# EAGLE schematic pure_battery (EAGLE 9.5.2)
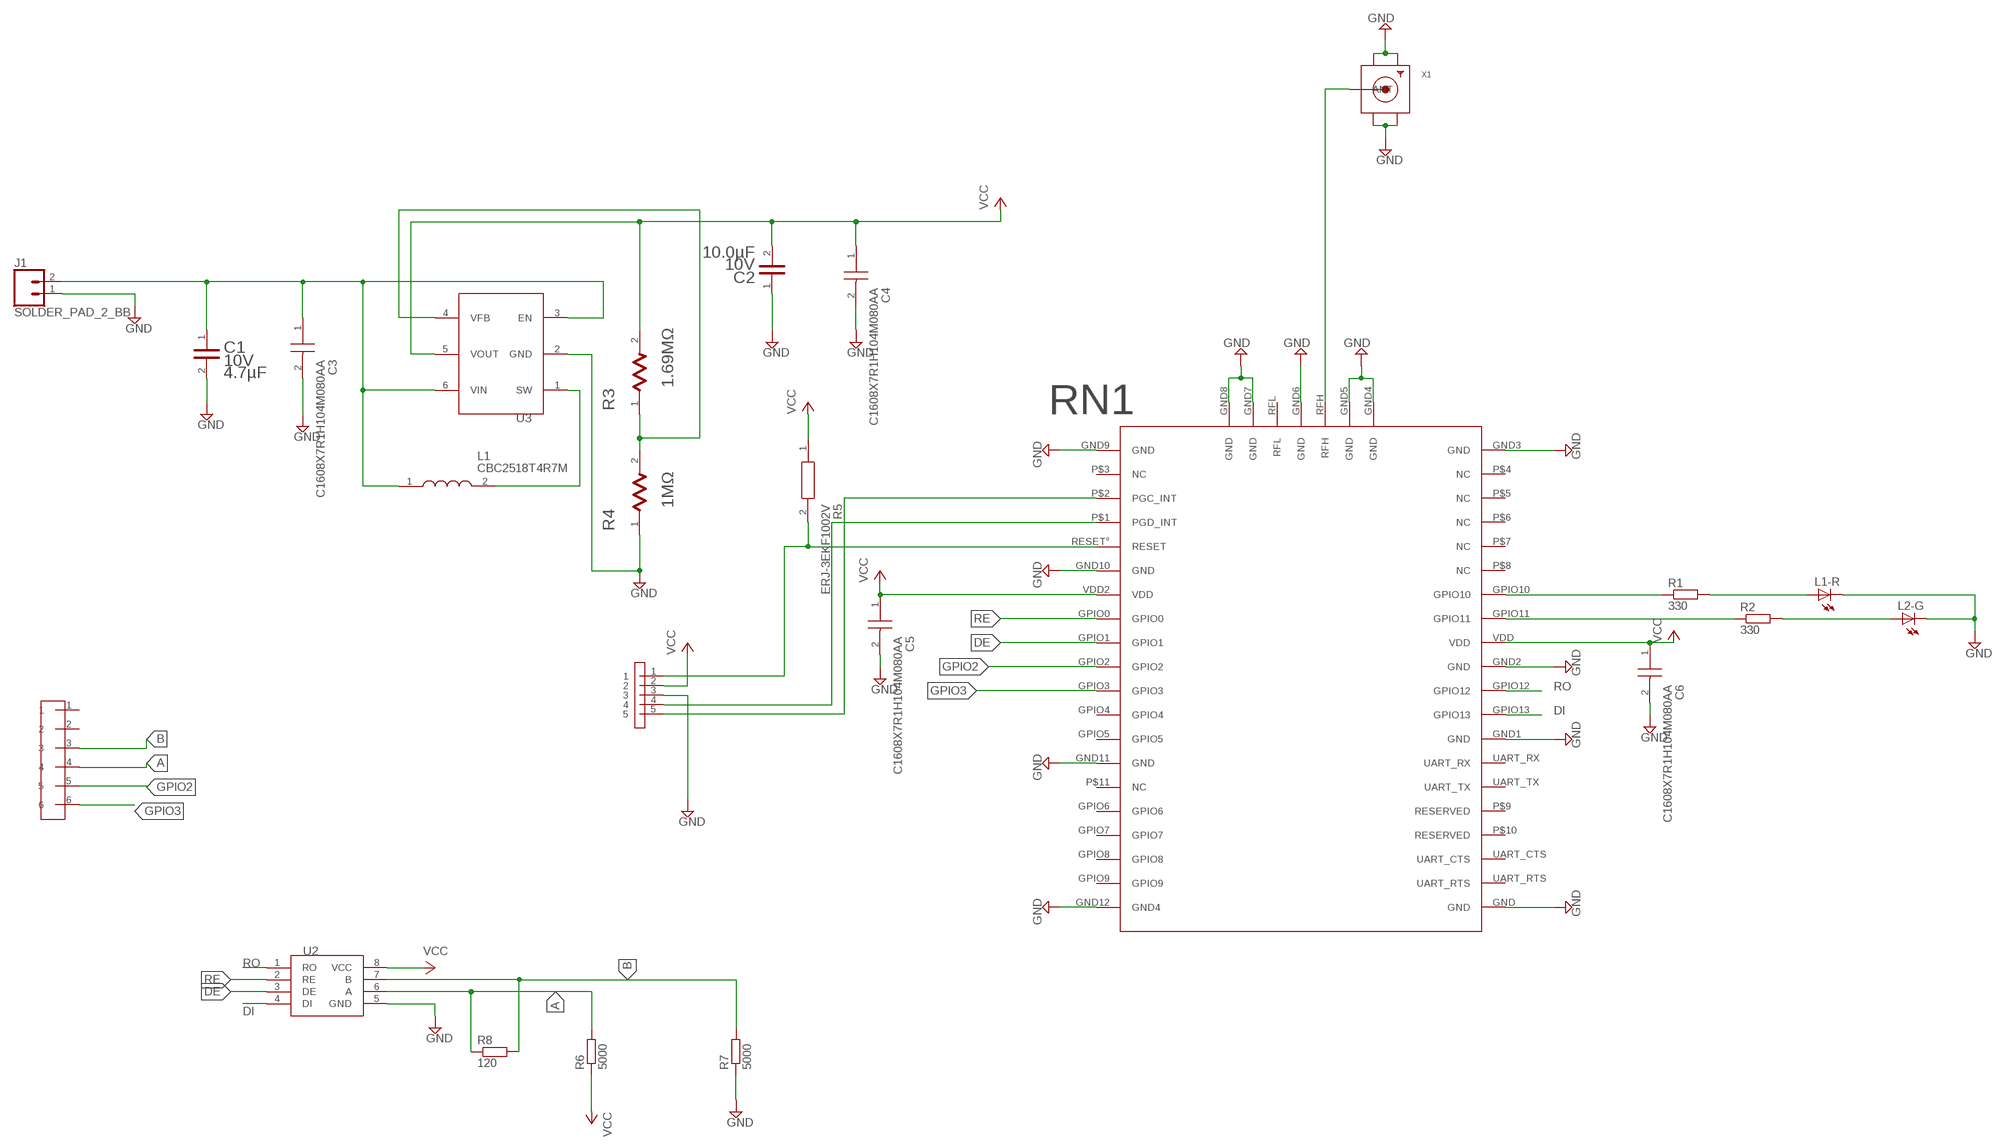
[diagram p0: schematic, sheet 1]

## Parts
C1  KEMET_C0603C475K8PACTUKEMET_C0603C475K8PACTU_0_0  [KEMET_C0603C475K8PACTU_0]
C2  TDK_C1608X5R1A106M080ACTDK_C1608X5R1A106M080AC_0_0  [TDK_C1608X5R1A106M080AC_0]
C3  C1608X7R1H104M080AA  [CAPC1608X80N]
C4  C1608X7R1H104M080AA  [CAPC1608X80N]
C5  C1608X7R1H104M080AA  [CAPC1608X80N]
C6  C1608X7R1H104M080AA  [CAPC1608X80N]
J1  SOLDER_PAD_2_BB  [SOLDER_PAD_2]
L1  CBC2518T4R7M  [INDC2518X200N]
L1-R  LEDCHIP-LED0603  [CHIP-LED0603]
L2-G  LEDCHIP-LED0603  [CHIP-LED0603]
R1  330  R-EU_R0603  [R0603]
R2  330  R-EU_R0603  [R0603]
R3  VISHAY_CRCW06031M69FKEAVISHAY_CRCW06031M69FKEA_0_1  [VISHAY_CRCW06031M69FKEA_1]
R4  STACKPOLE_RMCF0603FT1M00STACKPOLE_RMCF0603FT1M00_0_1  [STACKPOLE_RMCF0603FT1M00_1]
R5  ERJ-3EKF1002V  [RESC1608X55N]
R6  5000  R-EU_R0805  [R0805]
R7  5000  R-EU_R0805  [R0805]
R8  120  R-EU_R0805  [R0805]
RN1  NEW_RN2483  [NEW_RN2483]
U2  AMD3485E  [AMD3485E]
U3  MCP16252  [MCP16252]
U$1  CONNECTOR6_V2  [CONNECTOR6_V2]
U$2  ICSP_V2  [ICSP_V2]
X1  SMACONNECTOR_EDGE  [SMA_EDGELAUNCH]

## Nets
A: R6.2 R8.1 U2.6(A) U$1.4
B: R7.2 R8.2 U2.7(B) U$1.3
DE: RN1.GPIO1 U2.3(DE)
DI: RN1.GPIO13 U2.4(DI)
GND: C1.2 C2.1 C3.2 C4.2 C5.2 C6.2 J1.1 L1-R.C L2-G.C R4.1 R7.1 RN1.GND RN1.GND1(GND) RN1.GND2(GND) RN1.GND3(GND) RN1.GND4(GND) RN1.GND5(GND) RN1.GND6(GND) RN1.GND7(GND) RN1.GND8(GND) RN1.GND9(GND) RN1.GND10(GND) RN1.GND11(GND) RN1.GND12(GND4) U2.5(GND) U3.2(GND) U$2.3 X1.GND@1(GND4) X1.GND@2(GND3) X1.GND@3(GND2) X1.GND@4(GND1)
GPIO2: RN1.GPIO2 U$1.5
GPIO3: RN1.GPIO3 U$1.6
N$1: R1.1 RN1.GPIO10
N$2: L1-R.A R1.2
N$3: C1.1 C3.1 J1.2 L1.1 U3.3(EN) U3.6(VIN)
N$4: R2.1 RN1.GPIO11
N$5: L2-G.A R2.2
N$6: RN1.P$2(PGC_INT) U$2.5
N$7: L1.2 U3.1(SW)
N$8: R3.1 R4.2 U3.4(VFB)
N$9: RN1.P$1(PGD_INT) U$2.4
N$11: R5.2 RN1.RESET°(RESET) U$2.1
N$12: RN1.RFH X1.P(ANT)
RE: RN1.GPIO0 U2.2(RE)
RO: RN1.GPIO12 U2.1(RO)
VCC: C2.2 C4.1 C5.1 C6.1 R3.2 R5.1 R6.1 RN1.VDD RN1.VDD2(VDD) U2.8(VCC) U3.5(VOUT) U$2.2
Unconnected: RN1.GPIO4 RN1.GPIO5 RN1.GPIO6 RN1.GPIO7 RN1.GPIO8 RN1.GPIO9 RN1.P$3(NC) RN1.P$4(NC) RN1.P$5(NC) RN1.P$6(NC) RN1.P$7(NC) RN1.P$8(NC) RN1.P$9(RESERVED) RN1.P$10(RESERVED) RN1.P$11(NC) RN1.RFL RN1.UART_CTS RN1.UART_RTS RN1.UART_RX RN1.UART_TX U$1.1 U$1.2

## Library data of the parts
C1 = Kemet - C0603C475K8PACTU:KEMET_C0603C475K8PACTU: CAP CER 4.7UF 10V X5R 0603; CAPACITANCE: 4.7µF; CENTROID_NOT_SPECIFIED: No; DATASHEET: https://search.kemet.com/component-edge/download/datasheet/C0603C475K8PACTU.pdf; DIGIKEY_DESCRIPTION: CAP CER 4.7UF 10V X5R 0603; DIGIKEY_PART_NUMBER: 399-5503-1-ND; LEAD_FREE: yes; MF: Kemet; MFG_PACKAGE_IDENT: C0603; MOUSER_DESCRIPTION: Multilayer Ceramic Capacitors MLCC - SMD/SMT 10volts 4.7uF 10% X5R; MOUSER_PART_NUMBER: 80-C0603C475K8P; MPN: C0603C475K8PACTU; PACKAGE: 0603; PREFIX: C; ROHS: yes; TEMPERATURE_RANGE_HIGH: +85°C; TEMPERATURE_RANGE_LOW: -55°C; VOLTAGE: 10V
C2 = TDK - C1608X5R1A106M080AC:TDK_C1608X5R1A106M080AC: 10 uF Ceramic Capacitor; CAPACITANCE: 10.0µF; CAPACITANCE_TOLERANCE: ±20%; CENTROID_NOT_SPECIFIED: No; DATASHEET: https://product.tdk.com/info/en/catalog/datasheets/mlcc_commercial_general_en.pdf; DIELECTRIC_CHARACTERISTIC: X5R; DIELECTRIC_MATERIAL: Ceramic Multilayer; DIGIKEY_DESCRIPTION: CAP CER 10UF 10V X5R 0603; DIGIKEY_PART_NUMBER: 445-6853-1-ND; IMPORTED_FROM: octopart; IPC_LAND_PATTERN_NAME: CAPC16080X80; LEAD_FREE: yes; MF: TDK; MOUSER_PART_NUMBER: 810-C1608X5R1A106M; MPN: C1608X5R1A106M080AC; NUM_PINS: 2; OCTOPART_PART_NUMBER: f5f73d6e4e4d2a30; PACKAGE: 0603; PREFIX: C; ROHS: yes; SIZE_LENGTH: 1.6 mm; SIZE_THICKNESS: 800 um; SIZE_WIDTH: 800 um; TEMPERATURE_RANGE_HIGH: +85°C; TEMPERATURE_RANGE_LOW: -55°C; VOLTAGE: 10V; VOLTAGE_RATING_DC: 10 V
C3-C6 = C1608X7R1H104M080AA:C1608X7R1H104M080AA: TDK 0603 C 100nF Ceramic Multilayer Capacitor, 50 V dc, +125C, X7R Dielectric, +/-20% Source: Datasheet <https://product.tdk.com/info/en/catalog/datasheets/mlcc_commercial_midvoltage_en.pdf>; ARROW_PART_NUMBER: C1608X7R1H104M080AA; ARROW_PRICE-STOCK: https://www.arrow.com/en/products/c1608x7r1h104m080aa/tdk; DESCRIPTION: TDK 0603 C 100nF Ceramic Multilayer Capacitor, 50 V dc, +125C, X7R Dielectric, +/-20%; HEIGHT: 0.8mm; MANUFACTURER_NAME: TDK; MANUFACTURER_PART_NUMBER: C1608X7R1H104M080AA; MOUSER_PART_NUMBER: 810-C1608X7R1H104M; MOUSER_PRICE-STOCK: https://www.mouser.co.uk/ProductDetail/TDK/C1608X7R1H104M080AA?qs=dfay7wIA1uEL2BE%2FFUaTdg%3D%3D
J1 = SparkFun-Connectors:SOLDER_PAD_2_BB: Solder Pad for LuMini Rings
L1 = CBC2518T4R7M:CBC2518T4R7M: Fixed Inductors INDCTR HI CUR WND 1007 4.7uH 20% Source: Datasheet <http://ds.yuden.co.jp/TYCOMPAS/ut/detail.do?productNo=CBC2518T4R7M&dataUnit=M.pdf>; ARROW_PART_NUMBER: CBC2518T4R7M; DESCRIPTION: Fixed Inductors INDCTR HI CUR WND 1007 4.7uH 20%; HEIGHT: 2mm; MANUFACTURER_NAME: TAIYO YUDEN; MANUFACTURER_PART_NUMBER: CBC2518T4R7M; MOUSER_PART_NUMBER: 963-CBC2518T4R7M; MOUSER_PRICE-STOCK: https://www.mouser.com/Search/Refine.aspx?Keyword=963-CBC2518T4R7M
L1-R L2-G = adafruit:LED: LED OSRAM: - CHIPLED LG R971, LG N971, LY N971, LG Q971, LY Q971, LO R971, LY R971 LH N974, LH R974 LS Q976, LO Q976, LY Q976 LO Q996 - Hyper CHIPLED LW Q18S LB Q993, LB Q99A, LB R99A - SideLED LS A670, LO A670, LY A670, LG A670, LP A670 LB A673, LV A673, LT A673, LW A673 LH A674 LY A675 LS A676, LA A676, LO A676, LY A676, LW A676 LS A679, LY A679, LG A679 - Hyper Micro SIDELED® LS Y876, LA Y876, LO Y876, LY Y876 LT Y87S - SmartLED LW L88C, LW L88S LB L89C, LB L89S, LG L890 LS L89K, LO L89K, LY L89K LS L896, LA L896, LO L896, LY L896 - TOPLED LS T670, LO T670, LY T670, LG T670, LP T670 LSG T670, LSP T670, LSY T670, LOP T670, LYG T670 LG T671, LOG T671, LSG T671 LB T673, LV T673, LT T673, LW T673 LH T674 LS T676, LA T676, LO T676, LY T676, LB T676, LH T676, LSB T676, LW T676 LB T67C, LV T67C, LT T67C, LS T67K, LO T67K, LY T67K, LW E67C LS E67B, LA E67B, LO E67B, LY E67B, LB E67C, LV E67C, LT E67C LW T67C LS T679, LY T679, LG T679 LS T770, LO T770, LY T770, LG T770, LP T770 LB T773, LV T773, LT T773, LW T773 LH T774 LS E675, LA E675, LY E675, LS T675 LS T776, LA T776, LO T776, LY T776, LB T776 LHGB T686 LT T68C, LB T68C - Hyper Mini TOPLED® LB M676 - Mini TOPLED Santana® LG M470 LS M47K, LO M47K, LY M47K Source: http://www.osram.convergy.de/
R1 R2 R6-R8 = rcl:R-EU_: RESISTOR, European symbol; SPICEPREFIX: R
R3 = Vishay - CRCW06031M69FKEA:VISHAY_CRCW06031M69FKEA: RES Thick Film SMD 1.69MΩ 1% 1/10W 0603 100ppm/K; APPROVED_ALTERNATE_PART_NUMBER: 541-1.00HHCT-ND; CENTROID_NOT_SPECIFIED: No; COMPOSITION: Thick Film; DATASHEET: https://www.vishay.com/docs/20035/dcrcwe3.pdf; DEVICE_CLASS_L1: Passive Components; DEVICE_CLASS_L2: Resistors; DEVICE_CLASS_L3: Chip SMD Resistors; DIGIKEY_DESCRIPTION: RES SMD 1.69M OHM 1% 1/10W 0603; DIGIKEY_PART_NUMBER: 541-1.69MHTR-ND; FOOTPRINT_PARAMETERS_0: {"fp_type":"chip_res","params":{"L":{"nom":1550000,"long name":"Length","min":1500000,"max":1650000,"short name":"L","type":"measurement"},"W":{"nom":850000,"long name":"Width","min":750000,"max":950000,"short name":"W","type":"measurement"},"t":{"nom":450000,"long name":"Height","min":400000,"max":500000,"short name":"t","type":"measurement"},"b":{"nom":300000,"long name":"Terminal width","min":100000,"max":500000,"short name":"b","type":"measurement"},"P":{"default":"false","long name":"Polarized","type":"multichoice","short name":"P"},"offset x":{"nom":0,"long name":"X Center offset","min":null,"max":null,"short name":"offset x","type":"measurement"},"offset y":{"nom":0,"long name":"Y Center offset","min":null,"max":null,"short name":"offset y","type":"measurement"},"LS":{"long name":"Land shape","type":"fixed","short name":"LS","value":"Rectangle"},"solder toe":{"nom":550000,"long name":"Solder fillet (toe)","min":null,"max":null,"short name":"solder toe","type":"fixedmeasurement"},"solder heel":{"nom":-50000,"long name":"Solder fillet (heel)","min":null,"max":null,"short name":"solder heel","type":"fixedmeasurement"},"solder side":{"nom":50000,"long name":"Solder fillet (side)","min":null,"max":null,"short name":"solder side","type":"fixedmeasurement"},"courtyard":{"nom":500000,"long name":"Courtyard","min":null,"max":null,"short name":"courtyard","type":"fixedmeasurement"},"SF":{"default":"A (>= 1608 metric)","long name":"Packing level","type":"multichoiceparent","short name":"SF","help":"http://support.upverter.com/customer/portal/articles/978783-what-is-a-footprint-packing-level","children":["solder toe","solder heel","solder side","courtyard"]}}}; FOOTPRINT_PARAMETERS_1: {"fp_type":"chip_res","params":{"L":{"nom":1550000,"long name":"Length","min":1500000,"max":1650000,"short name":"L","type":"measurement"},"W":{"nom":850000,"long name":"Width","min":750000,"max":950000,"short name":"W","type":"measurement"},"t":{"nom":450000,"long name":"Height","min":400000,"max":500000,"short name":"t","type":"measurement"},"b":{"nom":300000,"long name":"Terminal width","min":100000,"max":500000,"short name":"b","type":"measurement"},"P":{"default":"false","long name":"Polarized","type":"multichoice","short name":"P"},"offset x":{"nom":0,"long name":"X Center offset","min":null,"max":null,"short name":"offset x","type":"measurement"},"offset y":{"nom":0,"long name":"Y Center offset","min":null,"max":null,"short name":"offset y","type":"measurement"},"LS":{"long name":"Land shape","type":"fixed","short name":"LS","value":"Rectangle"},"solder toe":{"nom":350000,"long name":"Solder fillet (toe)","min":null,"max":null,"short name":"solder toe","type":"fixedmeasurement"},"solder heel":{"nom":-50000,"long name":"Solder fillet (heel)","min":null,"max":null,"short name":"solder heel","type":"fixedmeasurement"},"solder side":{"nom":0,"long name":"Solder fillet (side)","min":null,"max":null,"short name":"solder side","type":"fixedmeasurement"},"courtyard":{"nom":250000,"long name":"Courtyard","min":null,"max":null,"short name":"courtyard","type":"fixedmeasurement"},"SF":{"default":"B (>= 1608 metric)","long name":"Packing level","type":"multichoiceparent","short name":"SF","help":"http://support.upverter.com/customer/portal/articles/978783-what-is-a-footprint-packing-level","children":["solder toe","solder heel","solder side","courtyard"]}}}; FOOTPRINT_PARAMETERS_2: {"fp_type":"chip_res","params":{"L":{"nom":1550000,"long name":"Length","min":1500000,"max":1650000,"short name":"L","type":"measurement"},"W":{"nom":850000,"long name":"Width","min":750000,"max":950000,"short name":"W","type":"measurement"},"t":{"nom":450000,"long name":"Height","min":400000,"max":500000,"short name":"t","type":"measurement"},"b":{"nom":300000,"long name":"Terminal width","min":100000,"max":500000,"short name":"b","type":"measurement"},"P":{"default":"false","long name":"Polarized","type":"multichoice","short name":"P"},"offset x":{"nom":0,"long name":"X Center offset","min":null,"max":null,"short name":"offset x","type":"measurement"},"offset y":{"nom":0,"long name":"Y Center offset","min":null,"max":null,"short name":"offset y","type":"measurement"},"LS":{"long name":"Land shape","type":"fixed","short name":"LS","value":"Rectangle"},"solder toe":{"nom":150000,"long name":"Solder fillet (toe)","min":null,"max":null,"short name":"solder toe","type":"fixedmeasurement"},"solder heel":{"nom":-50000,"long name":"Solder fillet (heel)","min":null,"max":null,"short name":"solder heel","type":"fixedmeasurement"},"solder side":{"nom":-50000,"long name":"Solder fillet (side)","min":null,"max":null,"short name":"solder side","type":"fixedmeasurement"},"courtyard":{"nom":100000,"long name":"Courtyard","min":null,"max":null,"short name":"courtyard","type":"fixedmeasurement"},"SF":{"default":"C (>= 1608 metric)","long name":"Packing level","type":"multichoiceparent","short name":"SF","help":"http://support.upverter.com/customer/portal/articles/978783-what-is-a-footprint-packing-level","children":["solder toe","solder heel","solder side","courtyard"]}}}; FOOTPRINT_VARIANT_NAME_0: IPC_A; FOOTPRINT_VARIANT_NAME_1: IPC_B; FOOTPRINT_VARIANT_NAME_2: IPC_C; FOOTPRINT_VARIANT_NAME_3: Recommended_Land_Pattern; HEIGHT: 0.5mm; IPC_LAND_PATTERN_NAME: RESC15585X45; LEAD_FREE: yes; MF: Vishay; MFG_PACKAGE_IDENT: CRCW0603; MFG_PACKAGE_IDENT_DATE: 0; MFG_PACKAGE_IDENT_REV: 0; MOUSER_DESCRIPTION: Thick Film Resistors - SMD 1/10watt 1.69Mohms 1%; MOUSER_PART_NUMBER: 71-CRCW06031M69FKEA; MPN: CRCW06031M69FKEA; PACKAGE: 0603 (1608 Metric); POWER: 100mW; POWER_RATING: 0.1W; PREFIX: R; RESISTANCE: 1.69MΩ; ROHS: yes; SERIES: CRCW; STANDOFF_HEIGHT: 0mm; TEMPERATURE_COEFFICIENT: 100ppm/K; TEMPERATURE_RANGE_HIGH: +155°C; TEMPERATURE_RANGE_LOW: -55°C; TOLERANCE: 1%; VERIFICATION_VERSION: 0.0.0.1; VOLTAGE: 75V; VOLTAGE_RATING: 75V
R4 = Stackpole - RMCF0603FT1M00:STACKPOLE_RMCF0603FT1M00: RES Thick Film SMD 1MΩ 1% 1/10W 0603 100ppm/°C; APPROVED_ALTERNATE_PART_NUMBER: 541-1.00HHCT-ND; CENTROID_NOT_SPECIFIED: No; COMPOSITION: Thick Film; DATASHEET: https://www.seielect.com/Catalog/SEI-RMCF_RMCP.pdf; DEVICE_CLASS_L1: Passive Components; DEVICE_CLASS_L2: Resistors; DEVICE_CLASS_L3: Chip SMD Resistors; DIGIKEY_DESCRIPTION: RES TF 1/10W 1M OHM 1% 0603; DIGIKEY_PART_NUMBER: RMCF0603FT1M00-ND; FOOTPRINT_PARAMETERS_0: {"fp_type":"chip_res","params":{"L":{"nom":1550000,"long name":"Length","min":1500000,"max":1650000,"short name":"L","type":"measurement"},"W":{"nom":850000,"long name":"Width","min":750000,"max":950000,"short name":"W","type":"measurement"},"t":{"nom":450000,"long name":"Height","min":400000,"max":500000,"short name":"t","type":"measurement"},"b":{"nom":300000,"long name":"Terminal width","min":100000,"max":500000,"short name":"b","type":"measurement"},"P":{"default":"false","long name":"Polarized","type":"multichoice","short name":"P"},"offset x":{"nom":0,"long name":"X Center offset","min":null,"max":null,"short name":"offset x","type":"measurement"},"offset y":{"nom":0,"long name":"Y Center offset","min":null,"max":null,"short name":"offset y","type":"measurement"},"LS":{"long name":"Land shape","type":"fixed","short name":"LS","value":"Rectangle"},"solder toe":{"nom":550000,"long name":"Solder fillet (toe)","min":null,"max":null,"short name":"solder toe","type":"fixedmeasurement"},"solder heel":{"nom":-50000,"long name":"Solder fillet (heel)","min":null,"max":null,"short name":"solder heel","type":"fixedmeasurement"},"solder side":{"nom":50000,"long name":"Solder fillet (side)","min":null,"max":null,"short name":"solder side","type":"fixedmeasurement"},"courtyard":{"nom":500000,"long name":"Courtyard","min":null,"max":null,"short name":"courtyard","type":"fixedmeasurement"},"SF":{"default":"A (>= 1608 metric)","long name":"Packing level","type":"multichoiceparent","short name":"SF","help":"http://support.upverter.com/customer/portal/articles/978783-what-is-a-footprint-packing-level","children":["solder toe","solder heel","solder side","courtyard"]}}}; FOOTPRINT_PARAMETERS_1: {"fp_type":"chip_res","params":{"L":{"nom":1550000,"long name":"Length","min":1500000,"max":1650000,"short name":"L","type":"measurement"},"W":{"nom":850000,"long name":"Width","min":750000,"max":950000,"short name":"W","type":"measurement"},"t":{"nom":450000,"long name":"Height","min":400000,"max":500000,"short name":"t","type":"measurement"},"b":{"nom":300000,"long name":"Terminal width","min":100000,"max":500000,"short name":"b","type":"measurement"},"P":{"default":"false","long name":"Polarized","type":"multichoice","short name":"P"},"offset x":{"nom":0,"long name":"X Center offset","min":null,"max":null,"short name":"offset x","type":"measurement"},"offset y":{"nom":0,"long name":"Y Center offset","min":null,"max":null,"short name":"offset y","type":"measurement"},"LS":{"long name":"Land shape","type":"fixed","short name":"LS","value":"Rectangle"},"solder toe":{"nom":350000,"long name":"Solder fillet (toe)","min":null,"max":null,"short name":"solder toe","type":"fixedmeasurement"},"solder heel":{"nom":-50000,"long name":"Solder fillet (heel)","min":null,"max":null,"short name":"solder heel","type":"fixedmeasurement"},"solder side":{"nom":0,"long name":"Solder fillet (side)","min":null,"max":null,"short name":"solder side","type":"fixedmeasurement"},"courtyard":{"nom":250000,"long name":"Courtyard","min":null,"max":null,"short name":"courtyard","type":"fixedmeasurement"},"SF":{"default":"B (>= 1608 metric)","long name":"Packing level","type":"multichoiceparent","short name":"SF","help":"http://support.upverter.com/customer/portal/articles/978783-what-is-a-footprint-packing-level","children":["solder toe","solder heel","solder side","courtyard"]}}}; FOOTPRINT_PARAMETERS_2: {"fp_type":"chip_res","params":{"L":{"nom":1550000,"long name":"Length","min":1500000,"max":1650000,"short name":"L","type":"measurement"},"W":{"nom":850000,"long name":"Width","min":750000,"max":950000,"short name":"W","type":"measurement"},"t":{"nom":450000,"long name":"Height","min":400000,"max":500000,"short name":"t","type":"measurement"},"b":{"nom":300000,"long name":"Terminal width","min":100000,"max":500000,"short name":"b","type":"measurement"},"P":{"default":"false","long name":"Polarized","type":"multichoice","short name":"P"},"offset x":{"nom":0,"long name":"X Center offset","min":null,"max":null,"short name":"offset x","type":"measurement"},"offset y":{"nom":0,"long name":"Y Center offset","min":null,"max":null,"short name":"offset y","type":"measurement"},"LS":{"long name":"Land shape","type":"fixed","short name":"LS","value":"Rectangle"},"solder toe":{"nom":150000,"long name":"Solder fillet (toe)","min":null,"max":null,"short name":"solder toe","type":"fixedmeasurement"},"solder heel":{"nom":-50000,"long name":"Solder fillet (heel)","min":null,"max":null,"short name":"solder heel","type":"fixedmeasurement"},"solder side":{"nom":-50000,"long name":"Solder fillet (side)","min":null,"max":null,"short name":"solder side","type":"fixedmeasurement"},"courtyard":{"nom":100000,"long name":"Courtyard","min":null,"max":null,"short name":"courtyard","type":"fixedmeasurement"},"SF":{"default":"C (>= 1608 metric)","long name":"Packing level","type":"multichoiceparent","short name":"SF","help":"http://support.upverter.com/customer/portal/articles/978783-what-is-a-footprint-packing-level","children":["solder toe","solder heel","solder side","courtyard"]}}}; FOOTPRINT_VARIANT_NAME_0: IPC_A; FOOTPRINT_VARIANT_NAME_1: IPC_B; FOOTPRINT_VARIANT_NAME_2: IPC_C; FOOTPRINT_VARIANT_NAME_3: Recommended_Land_Pattern; HEIGHT: 0.5mm; IPC_LAND_PATTERN_NAME: RESC15585X45; LEAD_FREE: yes; MF: Stackpole; MFG_PACKAGE_IDENT: RMCF0603; MFG_PACKAGE_IDENT_DATE: 0; MFG_PACKAGE_IDENT_REV: 0; MPN: RMCF0603FT1M00; PACKAGE: 0603 (1608 Metric); POWER: 100mW; POWER_RATING: 0.1W; PREFIX: R; RESISTANCE: 1MΩ; ROHS: yes; SERIES: RMCF; STANDOFF_HEIGHT: 0mm; TEMPERATURE_COEFFICIENT: 100ppm/°C; TEMPERATURE_RANGE_HIGH: +155°C; TEMPERATURE_RANGE_LOW: -55°C; TOLERANCE: 1%; VERIFICATION_VERSION: 0.0.0.1; VOLTAGE: 75V; VOLTAGE_RATING: 75V
R5 = ERJ-3EKF1002V:ERJ-3EKF1002V: Thick Film Resistors - SMD 0603 10Kohms 1% AEC-Q200 Source: Datasheet <http://industrial.panasonic.com/cdbs/www-data/pdf/RDA0000/AOA0000C86.pdf>; ARROW_PART_NUMBER: ERJ-3EKF1002V; ARROW_PRICE-STOCK: https://www.arrow.com/en/products/erj-3ekf1002v/panasonic; DESCRIPTION: Thick Film Resistors - SMD 0603 10Kohms 1% AEC-Q200; HEIGHT: 0.55mm; MANUFACTURER_NAME: Panasonic; MANUFACTURER_PART_NUMBER: ERJ-3EKF1002V; MOUSER_PART_NUMBER: 667-ERJ-3EKF1002V; MOUSER_PRICE-STOCK: https://www.mouser.co.uk/ProductDetail/Panasonic/ERJ-3EKF1002V?qs=H7k1u0Mp9JSrGPQ5%2F5COuw%3D%3D
RN1 = tobias:NEW_RN2483
U2 = AMD3485E:AMD3485E
U3 = my_library:MCP16252
U$1 = conn4:CONNECTOR6_V2
U$2 = conn4:ICSP_V2
X1 = adafruit:SMACONNECTOR: SMA Connector 90° DIP SMA Connector, 50 Ohm (4UConnector: 07259)

## Net classes
0 default: width 0.203 mm, drill 0.508 mm, clearance 0.254 mm